# Altium schematic sheet Mother Board IMU.SchDoc
size A4
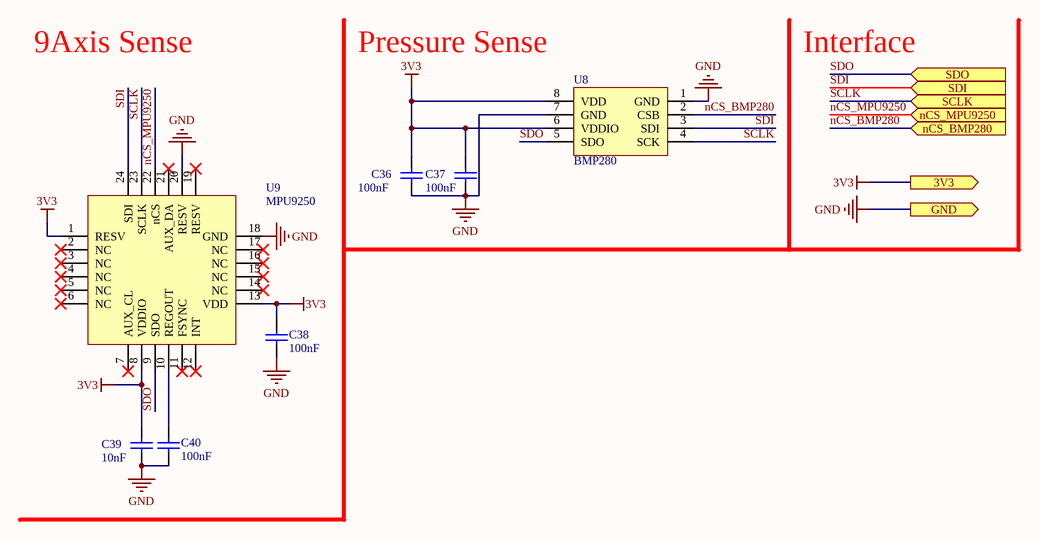
[diagram p0: Mother Board IMU.SchDoc]

## Parts
C36  100nF  [C0603]
C37  100nF  [C0603]
C38  100nF  [C0603]
C39  10nF  [C0603]
C40  100nF  [C0603]
U8  BMP280  [BMP280]
U9  MPU9250  [QFN24 3*3]

## Ports
3V3 (out), GND (out), nCS_BMP280 (in), nCS_MPU9250 (in), SCLK (in), SDI (in), SDO (in)

## Nets
3V3: C36.2 C37.2 C38.2 C39.2 U8.6(VDDIO) U8.8(VDD) U9.1(RESV) U9.8(VDDIO) U9.13(VDD) ; port 3V3
GND: C36.1 C37.1 C38.1 C39.1 C40.1 U8.1(GND) U8.7(GND) U9.18(GND) U9.20(RESV) ; port GND
nCS_BMP280: U8.2(CSB) ; port nCS_BMP280
nCS_MPU9250: U9.22(nCS) ; port nCS_MPU9250
SCLK: U8.4(SCK) U9.23(SCLK) ; port SCLK
SDI: U8.3(SDI) U9.24(SDI) ; port SDI
SDO: U8.5(SDO) U9.9(SDO) ; port SDO
NetC40_2: C40.2 U9.10(REGOUT)

Not connected (* = marked no-connect by the designer): U9 2(NC)* 3(NC)* 4(NC)* 5(NC)* 6(NC)* 7(AUX_CL)* 11(FSYNC)* 12(INT)* 14(NC)* 15(NC)* 16(NC)* 17(NC)* 19(RESV)* 21(AUX_DA)*

## Notes on the sheet
- 9Axis Sense
- (near U8) Pressure Sense
- Interface

## Library data of the parts
C36-C40 = Cap
U8 = BMP280: 气压计
U9 = MPU9250: 9轴 加速度 角速度 地磁传感器